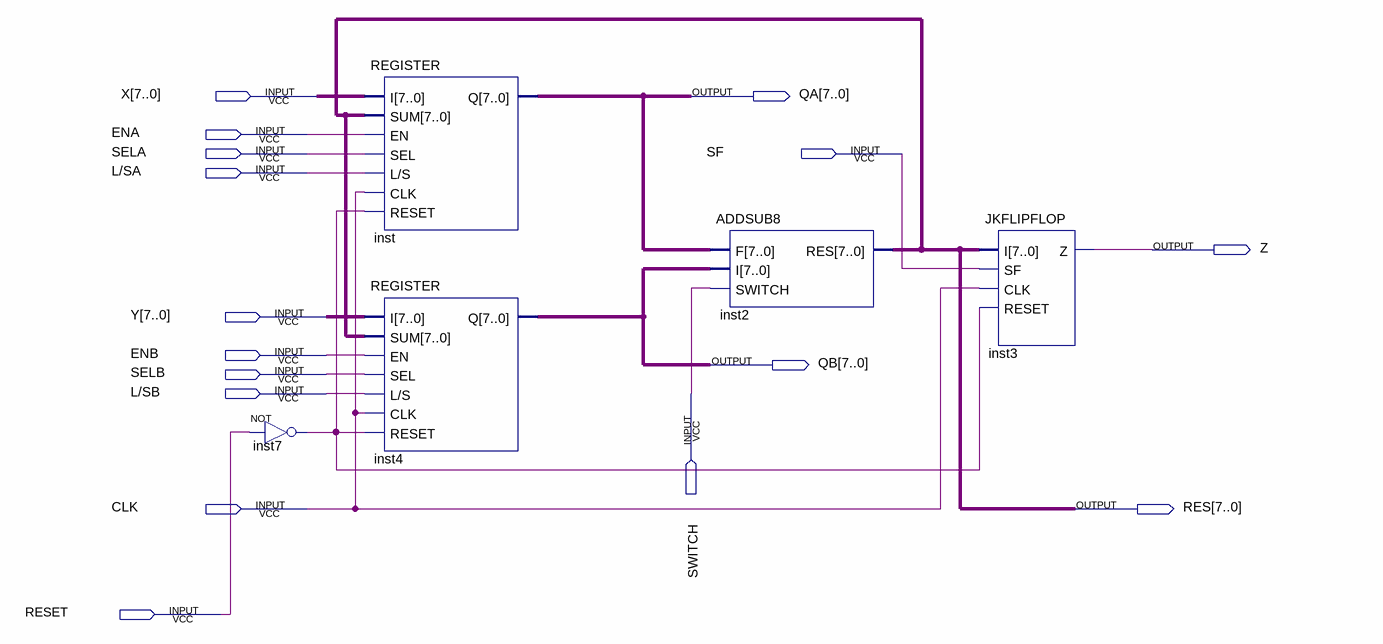
[diagram p0: schematic sheet]
// Quartus schematic DATAPATH.bdf as structural Verilog: 5 symbols, 16 pins
module DATAPATH (
  input  [7:0] X,
  input  ENA,
  input  SELA,
  input  SF,
  input  \L/SA ,
  input  [7:0] Y,
  input  ENB,
  input  SELB,
  input  \L/SB ,
  input  SWITCH,
  input  CLK,
  input  RESET,
  output [7:0] QA,
  output Z,
  output [7:0] QB,
  output [7:0] RES
);

  wire inst7_out;

  not inst7 (inst7_out, RESET);
  REGISTER inst (.I(X), .SUM(RES), .EN(ENA), .SEL(SELA), .\L/S (\L/SA ), .CLK(CLK), .RESET(inst7_out), .Q(QA));
  REGISTER inst4 (.I(Y), .SUM(RES), .EN(ENB), .SEL(SELB), .\L/S (\L/SB ), .CLK(CLK), .RESET(inst7_out), .Q(QB));
  ADDSUB8 inst2 (.F(QA), .I(QB), .SWITCH(SWITCH), .RES(RES));
  JKFLIPFLOP inst3 (.I(RES), .SF(SF), .CLK(CLK), .RESET(inst7_out), .Z(Z));
endmodule
